# Altium schematic sheet Nixie_4.SchDoc
size A4; SheetNumber: 7; SheetTotal: 7
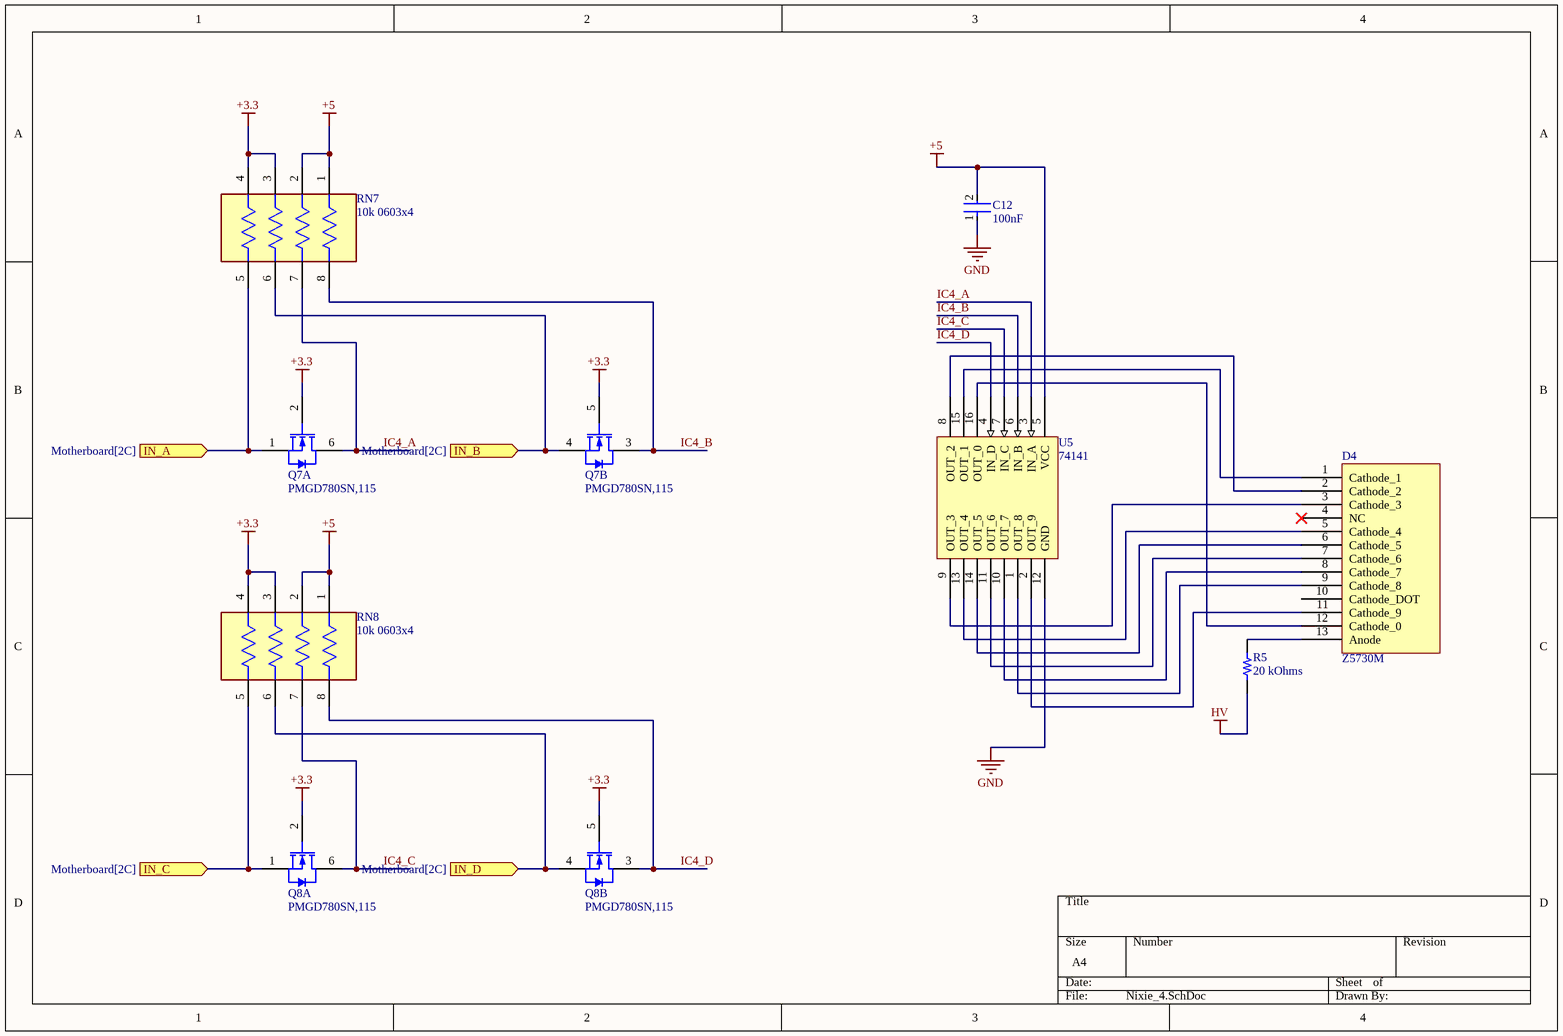
[diagram p0: Nixie_4.SchDoc]

## Parts
C12  100nF  [FP-C1005-050-0_15-MFG]
D4  Z5730M  [Z5730M]
Q7  PMGD780SN,115  [NXP-SOT363_N]  (parts A,B of 2)
Q8  PMGD780SN,115  [NXP-SOT363_N]  (parts A,B of 2)
R5  20 kOhms  [RES 1210_3225]
RN7  10k 0603x4  [FP-EXB38V-MFG]
RN8  10k 0603x4  [FP-EXB38V-MFG]
U5  74141  [DIP-16]

## Ports
IN_A (in, see Motherboard[2C]), IN_B (in, see Motherboard[2C]), IN_C (in, see Motherboard[2C]), IN_D (in, see Motherboard[2C])

## Nets
+3.3: Q7.2(G1) Q7.5(G2) Q8.2(G1) Q8.5(G2) RN7.3 RN7.4 RN8.3 RN8.4
+5: C12.2 RN7.1 RN7.2 RN8.1 RN8.2 U5.5(VCC)
GND: C12.1 U5.12(GND)
HV: R5.1
IC4_A: Q7.6(D1) RN7.7 U5.3(IN_A)
IC4_B: Q7.3(D2) RN7.8 U5.6(IN_B)
IC4_C: Q8.6(D1) RN8.7 U5.7(IN_C)
IC4_D: Q8.3(D2) RN8.8 U5.4(IN_D)
IN_A: Q7.1(S1) RN7.5 ; port IN_A
IN_B: Q7.4(S2) RN7.6 ; port IN_B
IN_C: Q8.1(S1) RN8.5 ; port IN_C
IN_D: Q8.4(S2) RN8.6 ; port IN_D
NetD4_1: D4.1(Cathode_1) U5.15(OUT_1)
NetD4_2: D4.2(Cathode_2) U5.8(OUT_2)
NetD4_3: D4.3(Cathode_3) U5.9(OUT_3)
NetD4_5: D4.5(Cathode_4) U5.13(OUT_4)
NetD4_6: D4.6(Cathode_5) U5.14(OUT_5)
NetD4_7: D4.7(Cathode_6) U5.11(OUT_6)
NetD4_8: D4.8(Cathode_7) U5.10(OUT_7)
NetD4_9: D4.9(Cathode_8) U5.1(OUT_8)
NetD4_11: D4.11(Cathode_9) U5.2(OUT_9)
NetD4_12: D4.12(Cathode_0) U5.16(OUT_0)
NetD4_13: D4.13(Anode) R5.2

Not connected (* = marked no-connect by the designer): D4 4(NC)* 10(Cathode_DOT)

## Library data of the parts
C12 = CMP-2000-05438-2: CAP CER 100nF 10V X5R 0402; Dielectric Material: Ceramic; Tolerance: 20%; Capacitance: 4.7uF; RoHS Compliant: Yes; Lead Free: Lead Free; Max Operating Temperature: 85°C; Case Code (Metric): 1005; Dielectric: X5R; Height: 0.5mm; Length: 1mm; Case Code (Imperial): 0402; Width: 0.02inch; Mount: Surface Mount; Case/Package: 0402; Min Operating Temperature: -55°C; Radiation Hardening: No; Resistor Type: Ceramic; Construction: Flat; REACH SVHC: No SVHC; Voltage Rating (DC): 10V; Voltage Rating: 10V; Package Quantity: 1; Termination: SMD/SMT; Thickness: 500um; Voltage: 10V; Packaging: Tape and Reel; Depth: 0.5mm; Weight: 2.3E-05oz; Series: C
Q7 Q8 = CMP-1258-00177-1: Dual N-Channel uTrenchMOS Standard Level FET, 60 V, 0.49 A, 6-Pin SOT363, Tape and Reel; Manufacturer: NXP Semiconductors; ID [max] (A): 0.49; Packing: Tape & Reel; Channel Type: N; Coss [typ] (pF): 5; VDS [max] (V): 60; VGSth [typ] (V): 2; Ciss [typ] (pF): 23; ComponentLink1Description: Manufacturer URL; ComponentLink2Description: Datasheet; ComponentLink2URL: http://www.nxp.com/documents/data_sheet/PMGD780SN.pdf; PackageReference: SOT363; PartNumber: PMGD780SN,115; Mounting Technology: Surface Mount; DatasheetVersion: Rev. 02; PackageDescription: 6-Pin Small Outline Transistor Package, Body 2 x 1.25 mm, Pitch 0.65 mm; ComponentLink3Description: Package Specification; Code_JEITA: SC-88; ComponentLink1URL: http://www.nxp.com/; ComponentLink3URL: http://www.nxp.com/documents/outline_drawing/sot363_po.pdf; PackageVersion: 06-03-16, 03/2006
R5 = CRCW121020K0FKEAHP: RES SMD 20K OHM 1% 3/4W 1210; Manufacturer: Vishay Dale; Power (Watts): 0.75W, 3/4W; Temperature Coefficient: ±100ppm/°C; Part Number: CRCW121020K0FKEAHP; ComponentLink1Description: Datasheet; ComponentLink1URL: http://www.vishay.com/docs/20043/crcwhpe3.pdf; ComponentLink2Description: DigiKey Link; ComponentLink2URL: http://digikey.com/product-detail/en/vishay-dale/CRCW121020K0FKEAHP/541-20.0KDCT-ND/2567330; Composition: Thick Film; Device Package: 1210 (3225 Metric); Features: Automotive AEC-Q200, Pulse Withstanding; Height - Seated (Max): 0.028" (0.70mm); LastUpdated: 27.03.2023 20:03:38; Lifecycle Status: Active; Minimum Order: 1; Number of Terminations: 2; Operating Temperature: -55°C ~ 155°C; Package / Case: 1210 (3225 Metric); Packaging: TapeAndReel; Part Status: Active; Price: 0.07; Ratings: AEC-Q200; Resistance: 20 kOhms; Series: CRCW-HP; Size / Dimension: 0.126" L x 0.098" W (3.20mm x 2.50mm); Supplier 1: DigiKey; Supplier Part Number 1: 541-20.0KDCT-ND; Supplier Device Package: 1210; Tolerance: ±1%; Value: 20 kOhms
RN7 RN8 = CMP-2000-05314-2: RES ARRAY 4 RES 10K OHM 1206 / RC-ML08W103JT; Number of Terminals/Pins: 8; Number of Elements: 4; Tolerance: 5%; Resistance: 10kR; Temperature Coefficient: 200ppm/°C; Power Per Element: 62.5mW; Voltage Rating (DC): 100V; Circuit Type: Isolated; Power Dissipation: 63mW; Voltage Rating: 50V; Max Operating Temperature: 125°C; Terminal Pitch: 0.8mm; Mount: Surface Mount; Width: 1.6mm; Military Standard: Not; Length: 3.2mm; Lead Free: Lead Free; Case Code (Imperial): 1206; Packaging: Tape and Reel; Height: 0.5mm; Package Quantity: 1; Number of Resistors: 4; Depth: 1.6mm; Number of Contacts: 8; Number of Pins: 8; Series: EXB; Min Operating Temperature: -55°C; Case Code (Metric): 3216; Case/Package: 1206; Radiation Hardening: No; Termination: Convex; Resistance Tolerance: 5%; RoHS Compliant: Yes; Size Code: 0603; Contact Plating: Tin; Technology: THICK FILM